# Altium schematic sheet Control_board.SchDoc: Communication Board
size A3; SheetNumber: 1
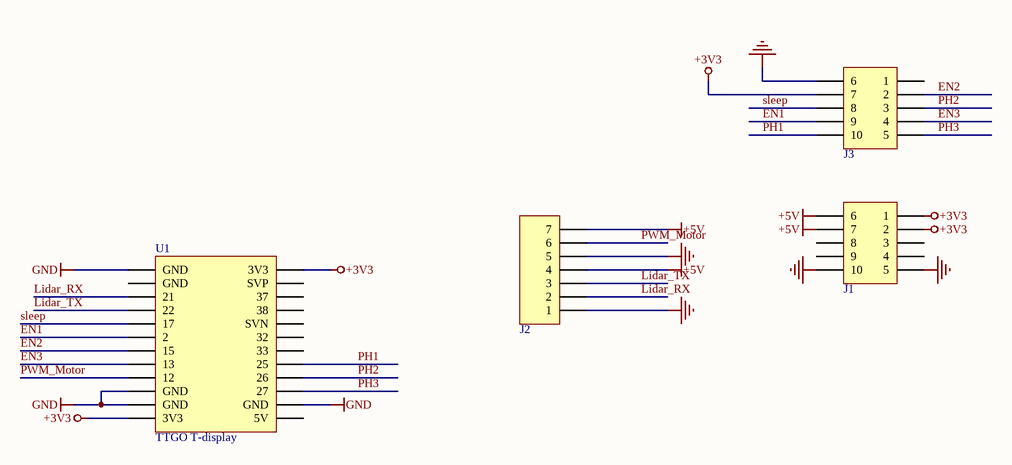
[diagram p0: Control_board.SchDoc]

## Parts
J1  10p  [61301021121]  (value not drawn)
J2  07p  [61300711121]  (value not drawn)
J3  10p  [61301021121]  (value not drawn)
U1  TTGO T-display  [ESP32-TTGO-TDISPLAY]

## Nets
+3V3: J1.1 J1.2 J3.7 U1.3V3 U1.3V3-(3V3)
+5V: J1.6 J1.7 J2.4 J2.7
GND: J1.5 J1.10 J2.1 J2.5 J3.6 U1.GND1(GND) U1.GND3(GND) U1.GND4(GND) U1.GND5(GND)
EN1: J3.9 U1.2
EN2: J3.2 U1.15
EN3: J3.4 U1.13
Lidar_RX: J2.2 U1.21
Lidar_TX: J2.3 U1.22
PH1: J3.10 U1.25
PH2: J3.3 U1.26
PH3: J3.5 U1.27
PWM_Motor: J2.6 U1.12
sleep: J3.8 U1.17

Not connected (* = marked no-connect by the designer): J1 3 4 8 9; J3 1; U1 5V 32 33 37 38 GND2(GND) SVN SVP

## Notes on the sheet
- Projeto:
- Data:
- Subtítulo:
- Folha:
- Revisão:

## Library data of the parts
J1 J3 = 61301021121: WR-PHD 2.54 mm THT Dual Pin Header, 10p; Vendor: Wurth Elektronik; Part Number: 61301021121; Value: 10p
J2 = 61300711121: WR-PHD 2.54 mm THT Pin Header, 07p; Vendor: Wurth Elektronik; Part Number: 61300711121; Value: 07p